# Altium schematic sheet Sheet1.SchDoc
size A; SheetNumber: 1; SheetTotal: 1
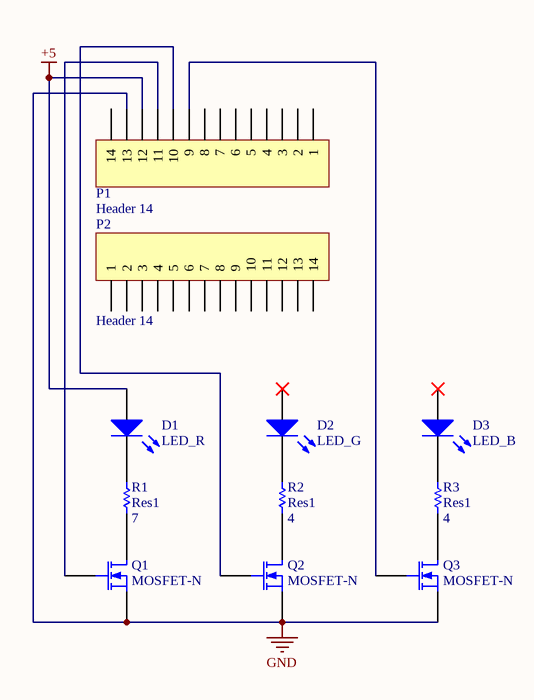
[diagram p0: Sheet1.SchDoc]

## Parts
D1  LED_R  [LED-0]
D2  LED_G  [LED-0]
D3  LED_B  [LED-0]
P1  Header 14  [HDR1X14]
P2  Header 14  [HDR1X14]
Q1  MOSFET-N  [E3]
Q2  MOSFET-N  [E3]
Q3  MOSFET-N  [E3]
R1  Res1  value 7  [AXIAL-0.3]
R2  Res1  value 4  [AXIAL-0.3]
R3  Res1  value 4  [AXIAL-0.3]

## Nets
+5: D1.1(A) P1.12
GND: P1.13 Q1.3(S) Q2.3(S) Q3.3(S)
NetD1_2: D1.2(K) R1.2
NetD2_2: D2.2(K) R2.2
NetD3_2: D3.2(K) R3.2
NetP1_9: P1.9 Q3.2(G)
NetP1_10: P1.10 Q2.2(G)
NetP1_11: P1.11 Q1.2(G)
NetQ1_1: Q1.1(D) R1.1
NetQ2_1: Q2.1(D) R2.1
NetQ3_1: Q3.1(D) R3.1

Not connected (* = marked no-connect by the designer): D2 1(A)*; D3 1(A)*; P1 1 2 3 4 5 6 7 8 14; P2 1 2 3 4 5 6 7 8 9 10 11 12 13 14

## Library data of the parts
D1-D3 = LED0: Typical INFRARED GaAs LED; Published: 8-Jun-2000; LatestRevisionDate: 08-Jul-2005; LatestRevisionNote: Mech Layer 1 removed.; PackageReference: LED-0; Publisher: Altium Limited; PackageDescription: LED; 2 Leads
P1 P2 = Header 14: Header, 14-Pin; LatestRevisionDate: 17-Jul-2002; LatestRevisionNote: Re-released for DXP Platform.; Publisher: Altium Limited
Q1-Q3 = MOSFET-N: N-Channel MOSFET; Published: 8-Jun-2000; LatestRevisionDate: 17-Jul-2002; LatestRevisionNote: Re-released for DXP Platform.; PackageVersion: 1995/1996; PackageReference: E3; Publisher: Altium Limited; PackageDescription: TO, Flat Index; 3 In-Line, Axial Leads; Body Dia. 4.6mm; Lead Dia. 0.5 mm (max)
R1-R3 = Res1: Resistor; Published: 8-Jun-2000; LatestRevisionDate: 17-Jul-2002; LatestRevisionNote: Re-released for DXP Platform.; PackageReference: AXIAL-0.3; Publisher: Altium Limited; PackageDescription: Axial Device, Thru-Hole; 2 Leads; 0.3 in Pin Spacing